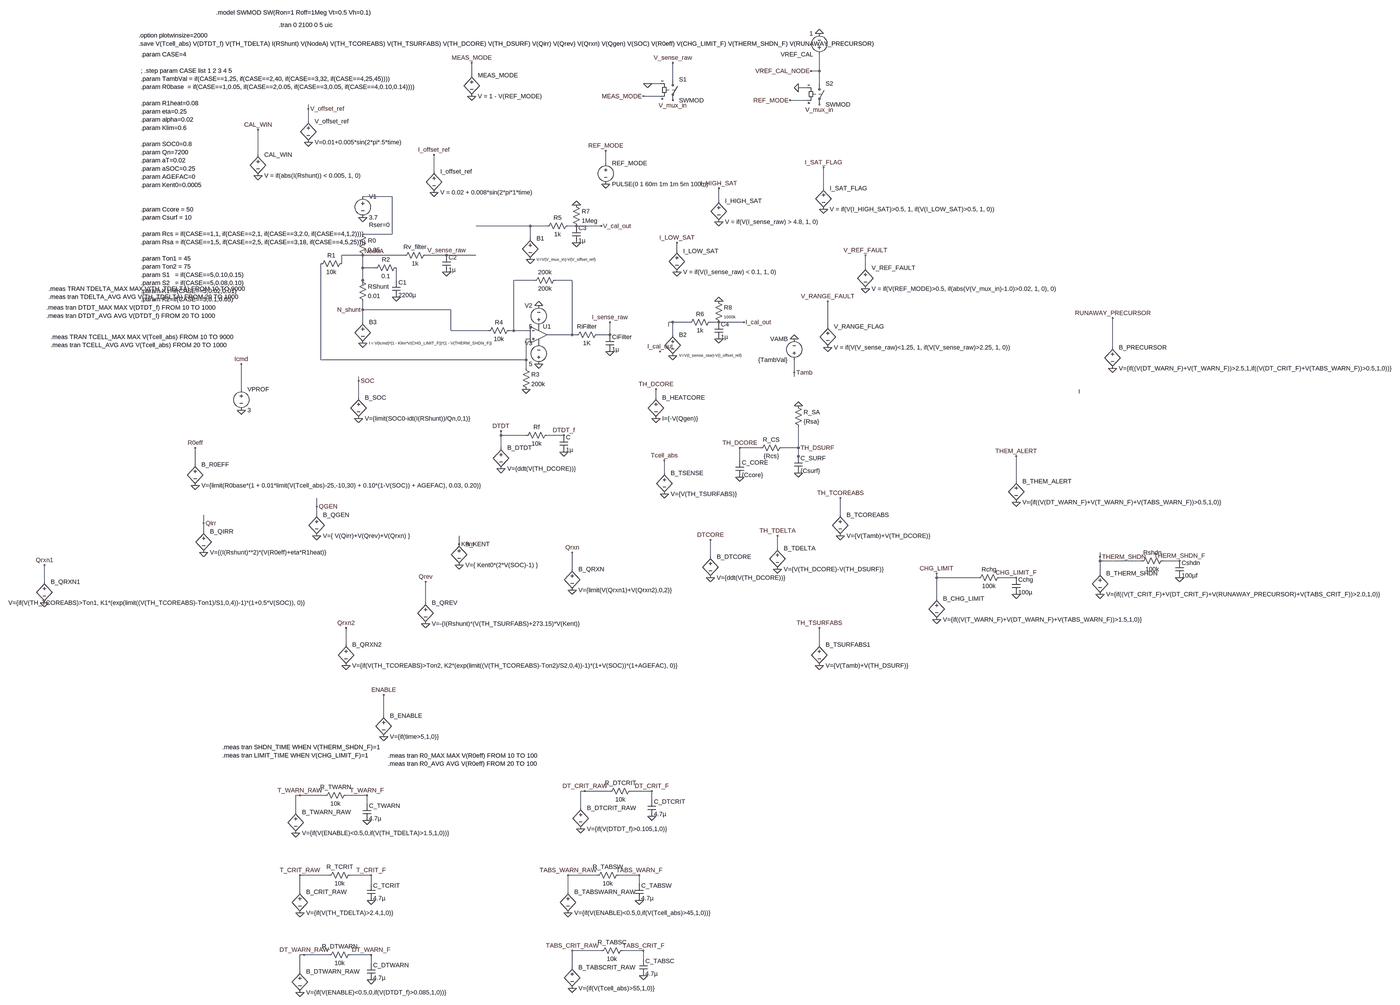
[diagram p0: schematic Thermalcase.asc, whole sheet]
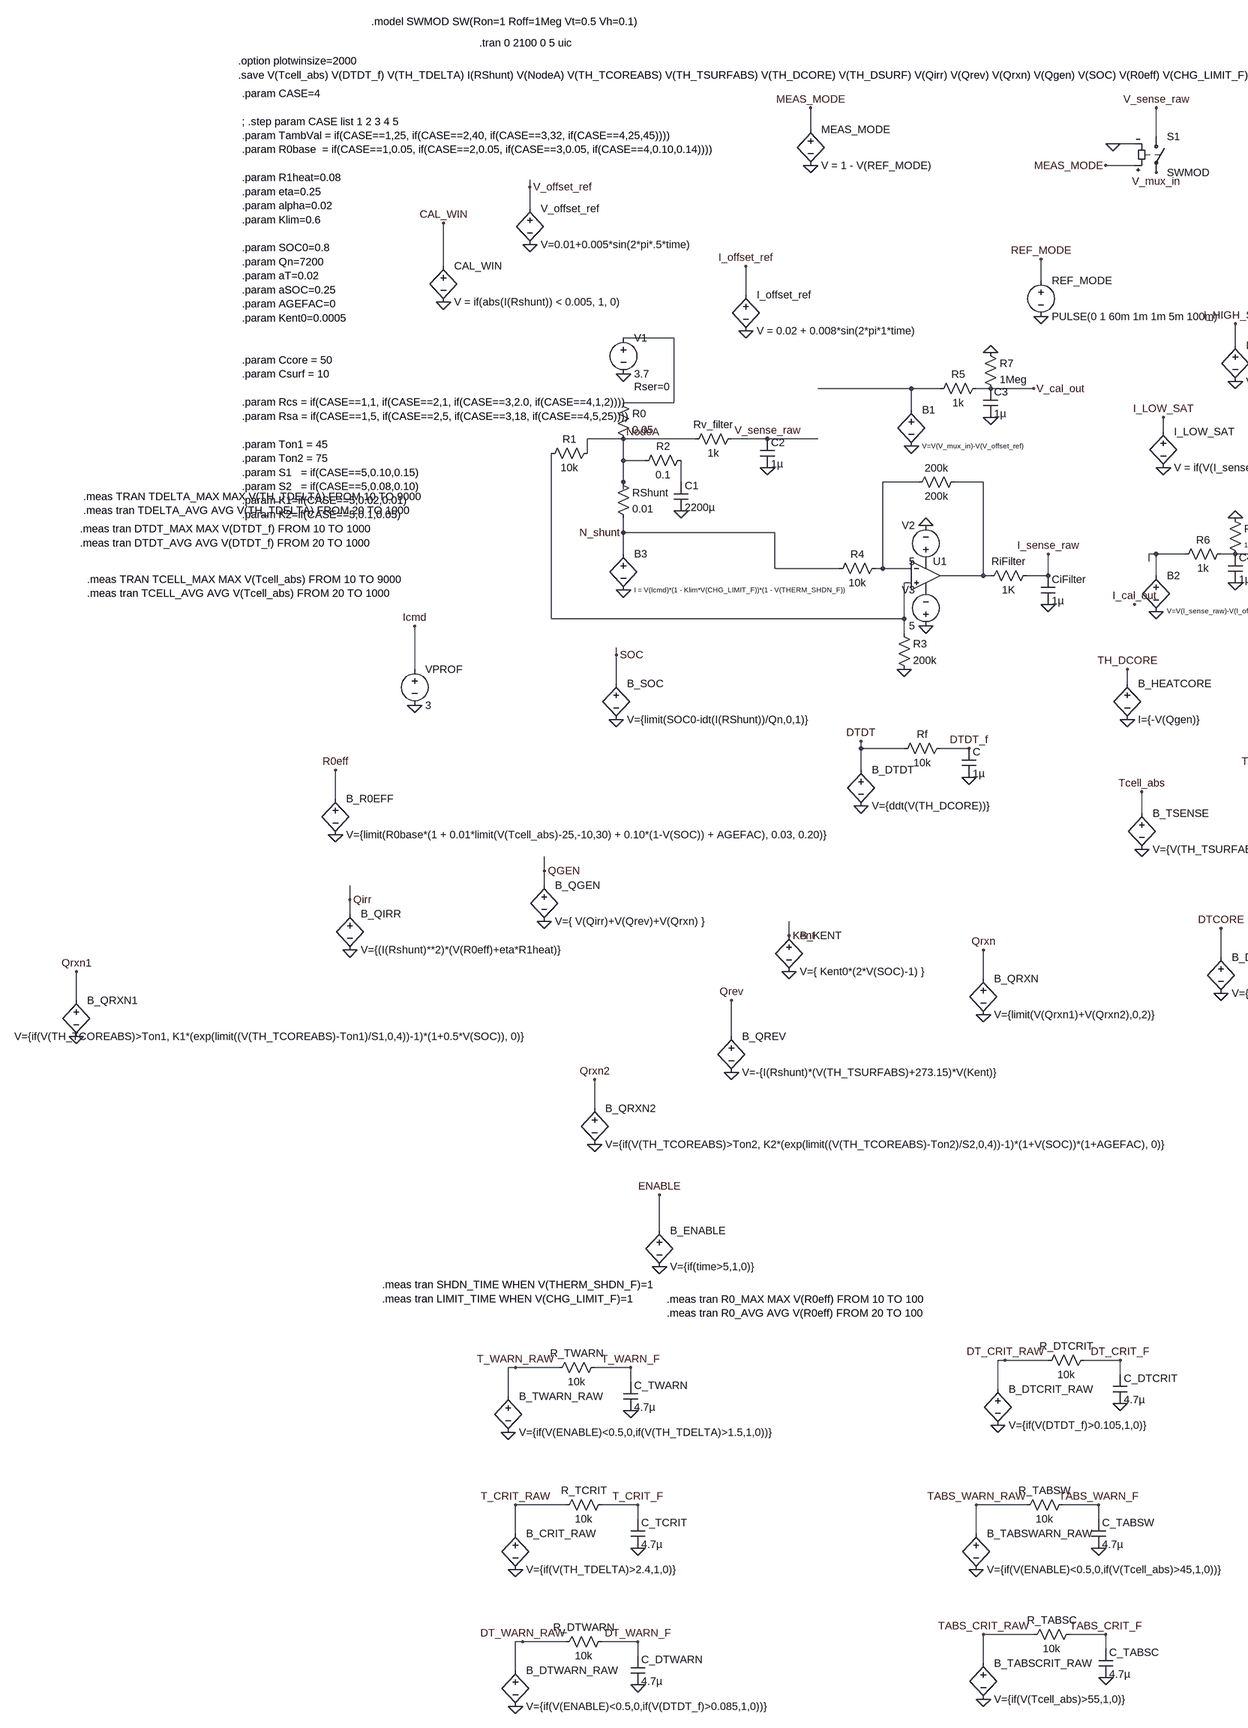
[diagram p1: schematic Thermalcase.asc, part, row 1 of 1, column 1 of 2]
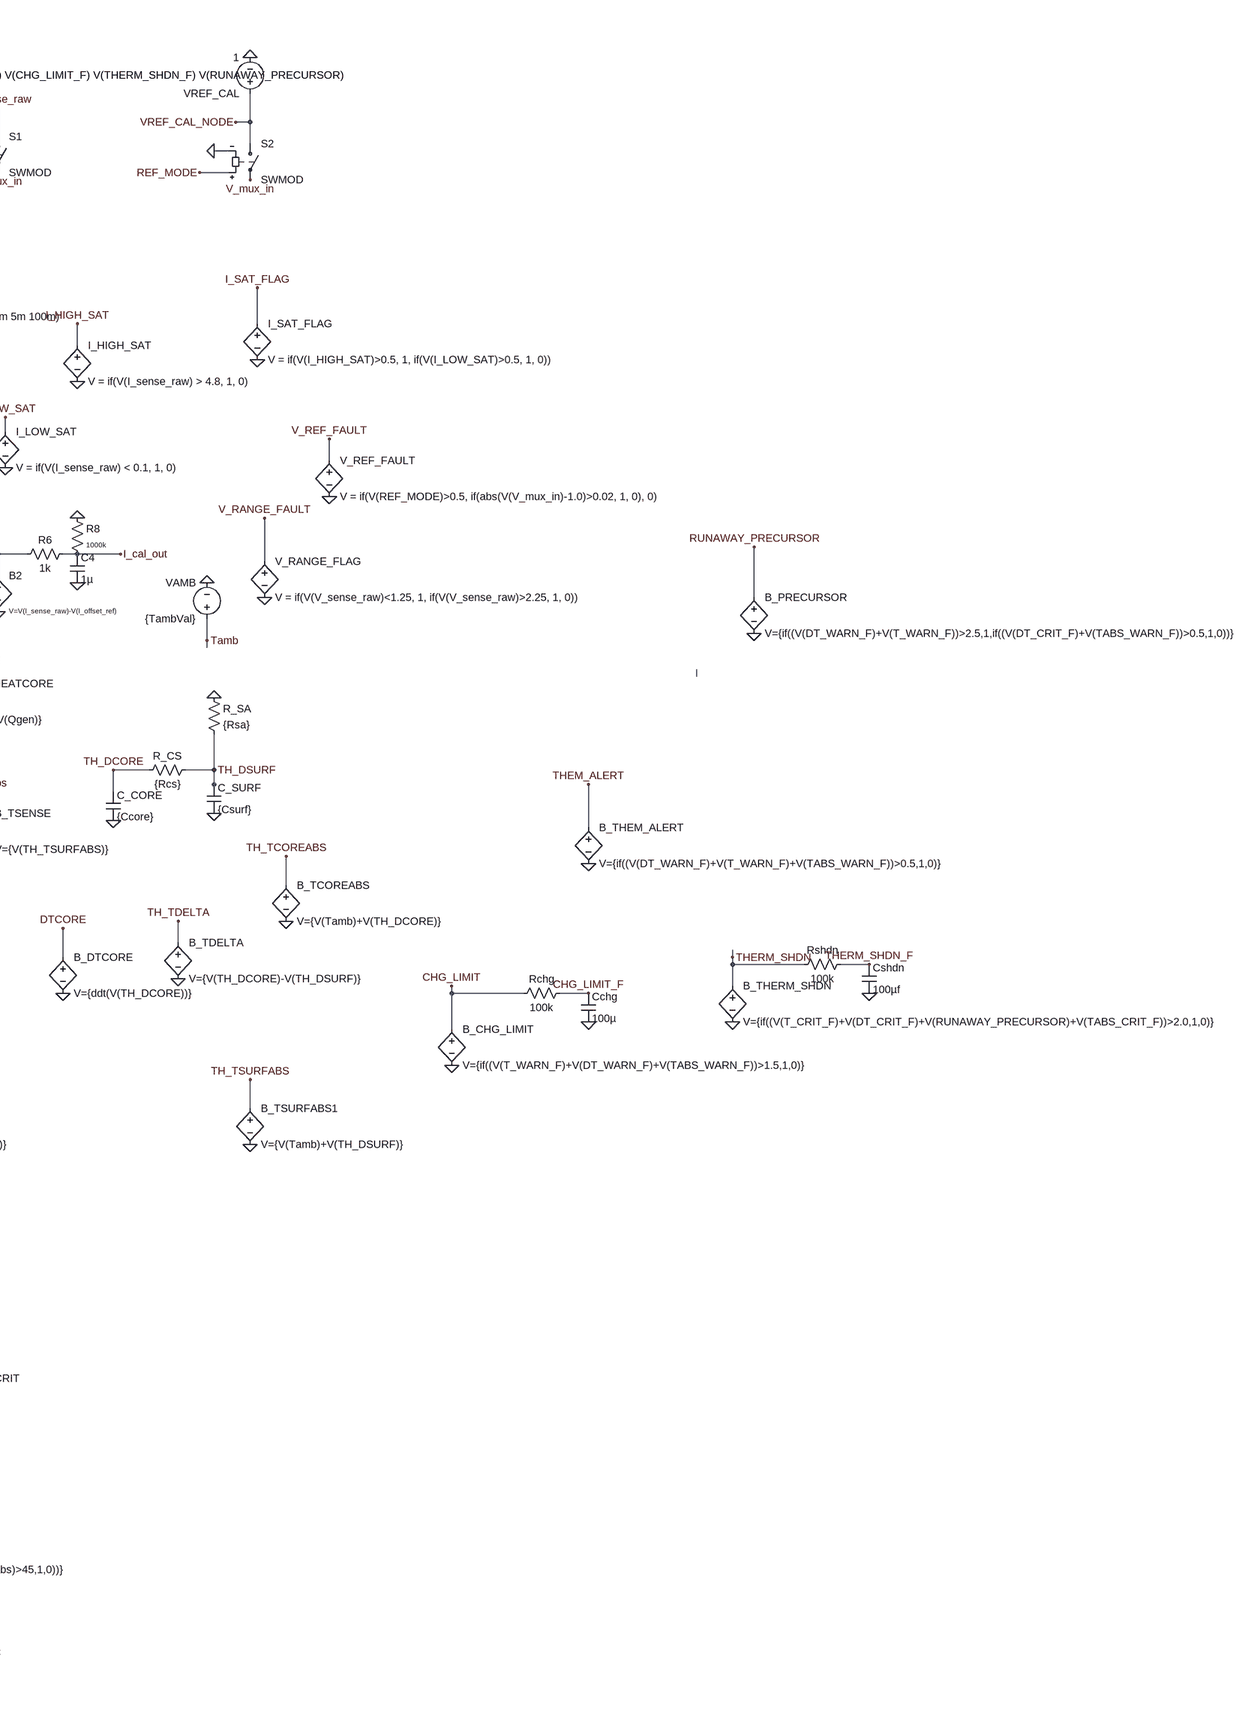
[diagram p2: schematic Thermalcase.asc, part, row 1 of 1, column 2 of 2]
Thermalcase.asc, the LTspice schematic file:
Version 4.1
SHEET 1 4508 3460
WIRE 1728 -464 1728 -528
WIRE 1728 -464 1696 -464
WIRE 400 -448 400 -496
WIRE 1168 -432 1168 -496
WIRE 1072 -416 1056 -416
WIRE 1120 -416 1072 -416
WIRE 1728 -416 1728 -464
WIRE 1680 -400 1648 -400
WIRE 1120 -368 1056 -368
WIRE 1680 -352 1616 -352
WIRE -224 -320 -224 -336
WIRE -224 -272 -224 -320
WIRE -416 -144 -416 -240
WIRE 912 -112 912 -160
WIRE 256 -80 256 -144
WIRE 1744 -16 1744 -96
WIRE 96 16 -16 16
WIRE 1344 32 1344 -16
WIRE 624 128 416 128
WIRE 688 128 624 128
WIRE 800 128 768 128
WIRE 896 128 800 128
WIRE 96 160 96 16
WIRE 96 160 -16 160
WIRE 624 176 624 128
WIRE 1184 224 1184 192
WIRE -16 240 -96 240
WIRE 144 240 -16 240
WIRE 304 240 224 240
WIRE 416 240 304 240
WIRE -96 272 -96 240
WIRE -16 288 -16 240
WIRE 32 288 -16 288
WIRE 1904 288 1904 240
WIRE -16 336 -16 288
WIRE 112 336 112 288
WIRE 640 336 560 336
WIRE 784 336 720 336
WIRE -16 352 -16 336
WIRE -16 448 -16 416
WIRE 320 448 -16 448
WIRE -16 496 -16 448
WIRE 1168 496 1152 496
WIRE 1232 496 1168 496
WIRE 1344 496 1312 496
WIRE 1440 496 1344 496
WIRE 1152 512 1152 496
WIRE 1760 512 1760 416
WIRE 320 528 320 448
WIRE 464 528 320 528
WIRE 560 528 560 336
WIRE 560 528 544 528
WIRE 624 528 560 528
WIRE 784 544 784 336
WIRE 784 544 688 544
WIRE 800 544 784 544
WIRE 928 544 928 496
WIRE 928 544 880 544
WIRE 1168 544 1168 496
WIRE 624 560 608 560
WIRE 2848 592 2848 480
WIRE -176 640 -176 272
WIRE 608 640 608 560
WIRE 608 640 -176 640
WIRE 608 672 608 640
WIRE 1632 688 1632 640
WIRE 1632 704 1632 688
WIRE -32 720 -32 704
WIRE -480 752 -480 656
WIRE 2720 768 2720 752
WIRE -32 784 -32 720
WIRE 1104 784 1104 752
WIRE 512 928 512 912
WIRE 608 928 512 928
WIRE 752 928 688 928
WIRE 512 976 512 928
WIRE 1504 976 1424 976
WIRE 1648 976 1648 896
WIRE 1648 976 1584 976
WIRE 1648 1008 1648 976
WIRE 1424 1024 1424 976
WIRE 1648 1024 1648 1008
WIRE -656 1040 -656 976
WIRE 1136 1072 1136 1024
WIRE 2480 1104 2480 1008
WIRE -192 1200 -192 1168
WIRE -192 1232 -192 1200
WIRE 1808 1232 1808 1168
WIRE -624 1264 -624 1232
WIRE -624 1296 -624 1264
WIRE 352 1344 352 1312
WIRE 1568 1360 1568 1312
WIRE 1312 1392 1312 1328
WIRE 2800 1392 2800 1376
WIRE 2800 1408 2800 1392
WIRE 2960 1408 2800 1408
WIRE 3104 1408 3040 1408
WIRE 784 1440 784 1376
WIRE 2800 1456 2800 1408
WIRE 2176 1472 2176 1456
WIRE 2336 1472 2176 1472
WIRE 2480 1472 2416 1472
WIRE -1232 1488 -1232 1424
WIRE 2176 1552 2176 1472
WIRE 224 1568 224 1488
WIRE -80 1728 -80 1664
WIRE 1728 1728 1728 1664
WIRE 64 2000 64 1920
WIRE 832 2288 816 2288
WIRE 928 2288 832 2288
WIRE 1088 2288 1008 2288
WIRE -256 2304 -272 2304
WIRE -160 2304 -256 2304
WIRE 0 2304 -80 2304
WIRE 1088 2320 1088 2288
WIRE 0 2336 0 2304
WIRE 816 2352 816 2288
WIRE -272 2368 -272 2304
WIRE -144 2656 -256 2656
WIRE 16 2656 -64 2656
WIRE 880 2656 768 2656
WIRE 1040 2656 960 2656
WIRE 16 2688 16 2656
WIRE 1040 2688 1040 2656
WIRE -256 2720 -256 2656
WIRE 768 2720 768 2656
WIRE 896 2944 784 2944
WIRE 1056 2944 976 2944
WIRE -240 2960 -256 2960
WIRE -144 2960 -240 2960
WIRE 16 2960 -64 2960
WIRE 1056 2976 1056 2944
WIRE 16 2992 16 2960
WIRE 784 3008 784 2944
WIRE -256 3024 -256 2960
FLAG -16 448 N_shunt
FLAG 304 240 V_sense_raw
FLAG -16 240 NodeA
FLAG 928 608 0
FLAG 928 496 I_sense_raw
FLAG -16 96 0
FLAG 608 752 0
FLAG 656 656 0
FLAG 656 432 0
FLAG 624 256 0
FLAG 800 192 0
FLAG 1344 560 0
FLAG 800 48 0
FLAG 1344 416 0
FLAG -224 -192 0
FLAG 256 0 0
FLAG 1728 -608 0
FLAG -416 -64 0
FLAG 1120 608 I_cal_out
FLAG 1440 496 I_cal_out
FLAG 896 128 V_cal_out
FLAG 912 -32 0
FLAG 1056 -368 MEAS_MODE
FLAG 1168 -496 V_sense_raw
FLAG 1168 -352 V_mux_in
FLAG 1696 -464 VREF_CAL_NODE
FLAG 1728 -336 V_mux_in
FLAG 1616 -352 REF_MODE
FLAG 1344 112 0
FLAG 1744 64 0
FLAG 1904 368 0
FLAG 1184 304 0
FLAG 1760 592 0
FLAG 400 -368 0
FLAG 1168 624 0
FLAG -416 -240 CAL_WIN
FLAG -224 -320 V_offset_ref
FLAG 400 -496 MEAS_MODE
FLAG 912 -160 REF_MODE
FLAG 1344 -16 I_HIGH_SAT
FLAG 1744 -96 I_SAT_FLAG
FLAG 1904 240 V_REF_FAULT
FLAG 1760 416 V_RANGE_FAULT
FLAG 1184 192 I_LOW_SAT
FLAG 256 -144 I_offset_ref
FLAG 1072 -416 0
FLAG 1648 -400 0
FLAG 1632 560 0
FLAG 512 912 DTDT
FLAG 512 1056 0
FLAG 752 992 0
FLAG 752 928 DTDT_f
FLAG 2480 1184 0
FLAG 2480 1008 THEM_ALERT
FLAG 2848 672 0
FLAG 2800 1536 0
FLAG 2848 480 RUNAWAY_PRECURSOR
FLAG 2800 1392 THERM_SHDN
FLAG 2176 1632 0
FLAG 2176 1456 CHG_LIMIT
FLAG 1632 688 Tamb
FLAG -480 832 0
FLAG -480 656 Icmd
FLAG -16 576 0
FLAG 2480 1536 0
FLAG 2480 1472 CHG_LIMIT_F
FLAG 3104 1472 0
FLAG 3104 1408 THERM_SHDN_F
FLAG -32 864 0
FLAG -656 1120 0
FLAG -624 1376 0
FLAG 352 1424 0
FLAG 224 1648 0
FLAG -32 720 SOC
FLAG -656 976 R0eff
FLAG 224 1488 Qrev
FLAG 784 1376 Qrxn
FLAG 352 1344 Kent
FLAG -192 1200 QGEN
FLAG -192 1312 0
FLAG 784 1520 0
FLAG 1648 1072 0
FLAG 1424 1088 0
FLAG 1648 976 TH_DSURF
FLAG 1424 976 TH_DCORE
FLAG 1104 752 TH_DCORE
FLAG 1104 864 0
FLAG 1136 1152 0
FLAG 1136 1024 Tcell_abs
FLAG 1568 1440 0
FLAG 1568 1312 TH_TDELTA
FLAG 1312 1472 0
FLAG 1312 1328 DTCORE
FLAG -1232 1424 Qrxn1
FLAG -1232 1568 0
FLAG -80 1664 Qrxn2
FLAG -80 1808 0
FLAG 1648 816 0
FLAG 1808 1312 0
FLAG 1808 1168 TH_TCOREABS
FLAG 1728 1808 0
FLAG 1728 1664 TH_TSURFABS
FLAG -624 1264 Qirr
FLAG 64 2080 0
FLAG 64 1920 ENABLE
FLAG -272 2448 0
FLAG 16 2752 0
FLAG -256 2800 0
FLAG -256 3104 0
FLAG 816 2432 0
FLAG 768 2800 0
FLAG 784 3088 0
FLAG 0 2400 0
FLAG 1088 2384 0
FLAG 1040 2752 0
FLAG 1056 3040 0
FLAG 16 3056 0
FLAG -256 2304 T_WARN_RAW
FLAG -256 2656 T_CRIT_RAW
FLAG -240 2960 DT_WARN_RAW
FLAG 832 2288 DT_CRIT_RAW
FLAG 768 2656 TABS_WARN_RAW
FLAG 784 2944 TABS_CRIT_RAW
FLAG 0 2304 T_WARN_F
FLAG 16 2656 T_CRIT_F
FLAG 16 2960 DT_WARN_F
FLAG 1088 2288 DT_CRIT_F
FLAG 1040 2656 TABS_WARN_F
FLAG 1056 2944 TABS_CRIT_F
FLAG 304 304 0
FLAG 112 400 0
SYMBOL voltage -16 0 R0
WINDOW 123 0 0 Left 0
WINDOW 39 24 124 Left 2
SYMATTR SpiceLine Rser=0
SYMATTR InstName V1
SYMATTR Value 3.7
SYMBOL res -32 144 R0
SYMATTR InstName R0
SYMATTR Value 0.05
SYMBOL res 128 272 R90
WINDOW 0 0 56 VBottom 2
WINDOW 3 32 56 VTop 2
SYMATTR InstName R2
SYMATTR Value 0.1
SYMBOL cap 96 336 R0
SYMATTR InstName C1
SYMATTR Value 2200µ
SYMBOL res 240 224 R90
WINDOW 0 0 56 VBottom 2
WINDOW 3 32 56 VTop 2
SYMATTR InstName Rv_filter
SYMATTR Value 1k
SYMBOL cap 288 240 R0
SYMATTR InstName C2
SYMATTR Value 1µ
SYMBOL res -32 320 R0
SYMATTR InstName RShunt
SYMATTR Value 0.01
SYMBOL res 896 528 R90
WINDOW 0 0 56 VBottom 2
WINDOW 3 32 56 VTop 2
SYMATTR InstName RiFilter
SYMATTR Value 1K
SYMBOL cap 912 544 R0
SYMATTR InstName CiFilter
SYMATTR Value 1µ
SYMBOL res -80 256 R90
WINDOW 0 0 56 VBottom 2
WINDOW 3 32 56 VTop 2
SYMATTR InstName R1
SYMATTR Value 10k
SYMBOL res 592 656 R0
SYMATTR InstName R3
SYMATTR Value 200k
SYMBOL res 560 512 R90
WINDOW 0 0 56 VBottom 2
WINDOW 3 32 56 VTop 2
SYMATTR InstName R4
SYMATTR Value 10k
SYMBOL res 736 320 R90
WINDOW 0 0 56 VBottom 2
WINDOW 3 32 56 VTop 2
SYMATTR InstName 200k
SYMATTR Value 200k
SYMBOL OpAmps\\UniversalOpAmp2 656 544 R0
SYMATTR InstName U1
SYMBOL voltage 656 528 R180
WINDOW 0 24 96 Left 2
WINDOW 3 24 16 Left 2
WINDOW 123 0 0 Left 0
WINDOW 39 0 0 Left 0
SYMATTR InstName V2
SYMATTR Value 5
SYMBOL voltage 656 672 R180
WINDOW 0 24 96 Left 2
WINDOW 3 24 16 Left 2
WINDOW 123 0 0 Left 0
WINDOW 39 0 0 Left 0
SYMATTR InstName V3
SYMATTR Value 5
SYMBOL bv 624 160 R0
WINDOW 3 24 96 Left 1
SYMATTR Value V=V(V_mux_in)-V(V_offset_ref)
SYMATTR InstName B1
SYMBOL bv 1168 528 R0
WINDOW 3 24 94 Left 1
SYMATTR Value V=V(I_sense_raw)-V(I_offset_ref)
SYMATTR InstName B2
SYMBOL res 784 112 R90
WINDOW 0 0 56 VBottom 2
WINDOW 3 32 56 VTop 2
SYMATTR InstName R5
SYMATTR Value 1k
SYMBOL cap 784 128 R0
SYMATTR InstName C3
SYMATTR Value 1µ
SYMBOL res 1328 480 R90
WINDOW 0 0 56 VBottom 2
WINDOW 3 32 56 VTop 2
SYMATTR InstName R6
SYMATTR Value 1k
SYMBOL cap 1328 496 R0
SYMATTR InstName C4
SYMATTR Value 1µ
SYMBOL res 784 32 R0
SYMATTR InstName R7
SYMATTR Value 1Meg
SYMBOL res 1328 400 R0
WINDOW 3 36 76 Left 1
SYMATTR Value 1000k
SYMATTR InstName R8
SYMBOL voltage 1728 -512 R180
WINDOW 123 0 0 Left 0
WINDOW 39 0 0 Left 0
SYMATTR InstName VREF_CAL
SYMATTR Value 1
SYMBOL bv -224 -288 R0
SYMATTR InstName V_offset_ref
SYMATTR Value V=0.01+0.005*sin(2*pi*.5*time)
SYMBOL bv 256 -96 R0
SYMATTR InstName I_offset_ref
SYMATTR Value V = 0.02 + 0.008*sin(2*pi*1*time)
SYMBOL bv -416 -160 R0
SYMATTR InstName CAL_WIN
SYMATTR Value V = if(abs(I(Rshunt)) < 0.005, 1, 0)
SYMBOL voltage 912 -128 R0
WINDOW 123 0 0 Left 0
WINDOW 39 0 0 Left 0
SYMATTR InstName REF_MODE
SYMATTR Value PULSE(0 1 60m 1m 1m 5m 100m)
SYMBOL sw 1168 -448 R0
SYMATTR InstName S1
SYMATTR Value SWMOD
SYMBOL sw 1728 -432 R0
SYMATTR InstName S2
SYMATTR Value SWMOD
SYMBOL bv 400 -464 R0
SYMATTR InstName MEAS_MODE
SYMATTR Value V = 1 - V(REF_MODE)
SYMBOL bv 1344 16 R0
SYMATTR InstName I_HIGH_SAT
SYMATTR Value V = if(V(I_sense_raw) > 4.8, 1, 0)
SYMBOL bv 1744 -32 R0
SYMATTR InstName I_SAT_FLAG
SYMATTR Value V = if(V(I_HIGH_SAT)>0.5, 1, if(V(I_LOW_SAT)>0.5, 1, 0))
SYMBOL bv 1184 208 R0
SYMATTR InstName I_LOW_SAT
SYMATTR Value V = if(V(I_sense_raw) < 0.1, 1, 0)
SYMBOL bv 1760 496 R0
SYMATTR InstName V_RANGE_FLAG
SYMATTR Value V = if(V(V_sense_raw)<1.25, 1, if(V(V_sense_raw)>2.25, 1, 0))
SYMBOL bv 1904 272 R0
SYMATTR InstName V_REF_FAULT
SYMATTR Value V = if(V(REF_MODE)>0.5, if(abs(V(V_mux_in)-1.0)>0.02, 1, 0), 0)
SYMBOL voltage 1632 656 R180
WINDOW 0 24 96 Left 2
WINDOW 3 24 16 Left 2
WINDOW 123 0 0 Left 0
WINDOW 39 0 0 Left 0
SYMATTR InstName VAMB
SYMATTR Value {TambVal}
SYMBOL bv 512 960 R0
SYMATTR InstName B_DTDT
SYMATTR Value V={ddt(V(TH_DCORE))}
SYMBOL res 704 912 R90
WINDOW 0 0 56 VBottom 2
WINDOW 3 32 56 VTop 2
SYMATTR InstName Rf
SYMATTR Value 10k
SYMBOL cap 736 928 R0
SYMATTR InstName C
SYMATTR Value 1µ
SYMBOL bv 2480 1088 R0
SYMATTR InstName B_THEM_ALERT
SYMATTR Value V={if((V(DT_WARN_F)+V(T_WARN_F)+V(TABS_WARN_F))>0.5,1,0)}
SYMBOL bv 2848 576 R0
SYMATTR InstName B_PRECURSOR
SYMATTR Value V={if((V(DT_WARN_F)+V(T_WARN_F))>2.5,1,if((V(DT_CRIT_F)+V(TABS_WARN_F))>0.5,1,0))}
SYMBOL bv 2800 1440 R0
SYMATTR InstName B_THERM_SHDN
SYMATTR Value V={if((V(T_CRIT_F)+V(DT_CRIT_F)+V(RUNAWAY_PRECURSOR)+V(TABS_CRIT_F))>2.0,1,0)}
SYMBOL bv 2176 1536 R0
SYMATTR InstName B_CHG_LIMIT
SYMATTR Value V={if((V(T_WARN_F)+V(DT_WARN_F)+V(TABS_WARN_F))>1.5,1,0)}
SYMBOL voltage -480 736 R0
WINDOW 123 0 0 Left 0
WINDOW 39 0 0 Left 0
SYMATTR InstName VPROF
SYMATTR Value 3
SYMBOL bv -16 480 R0
WINDOW 3 24 96 Left 1
SYMATTR Value I = V(Icmd)*(1 - Klim*V(CHG_LIMIT_F))*(1 - V(THERM_SHDN_F))
SYMATTR InstName B3
SYMBOL res 2432 1456 R90
WINDOW 0 0 56 VBottom 2
WINDOW 3 32 56 VTop 2
SYMATTR InstName Rchg
SYMATTR Value 100k
SYMBOL cap 2464 1472 R0
SYMATTR InstName Cchg
SYMATTR Value 100µ
SYMBOL res 3056 1392 R90
WINDOW 0 0 56 VBottom 2
WINDOW 3 32 56 VTop 2
SYMATTR InstName Rshdn
SYMATTR Value 100k
SYMBOL cap 3088 1408 R0
SYMATTR InstName Cshdn
SYMATTR Value 100µf
SYMBOL bv -32 768 R0
SYMATTR InstName B_SOC
SYMATTR Value V={limit(SOC0-idt(I(RShunt))/Qn,0,1)}
SYMBOL bv -656 1024 R0
SYMATTR Value V={limit(R0base*(1 + 0.01*limit(V(Tcell_abs)-25,-10,30) + 0.10*(1-V(SOC)) + AGEFAC), 0.03, 0.20)}
SYMATTR InstName B_R0EFF
SYMBOL bv -624 1280 R0
SYMATTR InstName B_QIRR
SYMATTR Value V={(I(Rshunt)**2)*(V(R0eff)+eta*R1heat)}
SYMBOL bv 352 1328 R0
SYMATTR InstName B_KENT
SYMATTR Value V={ Kent0*(2*V(SOC)-1) }
SYMBOL bv 224 1552 R0
SYMATTR InstName B_QREV
SYMATTR Value V=-{I(Rshunt)*(V(TH_TSURFABS)+273.15)*V(Kent)}
SYMBOL bv 784 1424 R0
SYMATTR InstName B_QRXN
SYMATTR Value V={limit(V(Qrxn1)+V(Qrxn2),0,2)}
SYMBOL bv -192 1216 R0
SYMATTR InstName B_QGEN
SYMATTR Value V={ V(Qirr)+V(Qrev)+V(Qrxn) }
SYMBOL res 1600 960 R90
WINDOW 0 0 56 VBottom 2
WINDOW 3 32 56 VTop 2
SYMATTR InstName R_CS
SYMATTR Value {Rcs}
SYMBOL cap 1632 1008 R0
SYMATTR InstName C_SURF
SYMATTR Value {Csurf}
SYMBOL cap 1408 1024 R0
SYMATTR InstName C_CORE
SYMATTR Value {Ccore}
SYMBOL res 1632 800 R0
SYMATTR InstName R_SA
SYMATTR Value {Rsa}
SYMBOL bv 1104 768 R0
SYMATTR InstName B_HEATCORE
SYMATTR Value I={-V(Qgen)}
SYMBOL bv 1136 1056 R0
SYMATTR InstName B_TSENSE
SYMATTR Value V={V(TH_TSURFABS)}
SYMBOL bv 1568 1344 R0
SYMATTR InstName B_TDELTA
SYMATTR Value V={V(TH_DCORE)-V(TH_DSURF)}
SYMBOL bv 1312 1376 R0
SYMATTR InstName B_DTCORE
SYMATTR Value V={ddt(V(TH_DCORE))}
SYMBOL bv -1232 1472 R0
WINDOW 3 428 96 Center 2
SYMATTR Value V={if(V(TH_TCOREABS)>Ton1, K1*(exp(limit((V(TH_TCOREABS)-Ton1)/S1,0,4))-1)*(1+0.5*V(SOC)), 0)}
SYMATTR InstName B_QRXN1
SYMBOL bv -80 1712 R0
SYMATTR Value V={if(V(TH_TCOREABS)>Ton2, K2*(exp(limit((V(TH_TCOREABS)-Ton2)/S2,0,4))-1)*(1+V(SOC))*(1+AGEFAC), 0)}
SYMATTR InstName B_QRXN2
SYMBOL bv 1808 1216 R0
SYMATTR InstName B_TCOREABS
SYMATTR Value V={V(Tamb)+V(TH_DCORE)}
SYMBOL bv 1728 1712 R0
SYMATTR InstName B_TSURFABS1
SYMATTR Value V={V(Tamb)+V(TH_DSURF)}
SYMBOL bv 64 1984 R0
SYMATTR InstName B_ENABLE
SYMATTR Value V={if(time>5,1,0)}
SYMBOL bv -272 2352 R0
SYMATTR InstName B_TWARN_RAW
SYMATTR Value V={if(V(ENABLE)<0.5,0,if(V(TH_TDELTA)>1.5,1,0))}
SYMBOL res -64 2288 R90
WINDOW 0 0 56 VBottom 2
WINDOW 3 32 56 VTop 2
SYMATTR InstName R_TWARN
SYMATTR Value 10k
SYMBOL bv -256 2704 R0
SYMATTR InstName B_CRIT_RAW
SYMATTR Value V={if(V(TH_TDELTA)>2.4,1,0)}
SYMBOL res -48 2640 R90
WINDOW 0 0 56 VBottom 2
WINDOW 3 32 56 VTop 2
SYMATTR InstName R_TCRIT
SYMATTR Value 10k
SYMBOL cap 0 2688 R0
SYMATTR InstName C_TCRIT
SYMATTR Value 4.7µ
SYMBOL bv -256 3008 R0
SYMATTR InstName B_DTWARN_RAW
SYMATTR Value V={if(V(ENABLE)<0.5,0,if(V(DTDT_f)>0.085,1,0))}
SYMBOL res -48 2944 R90
WINDOW 0 0 56 VBottom 2
WINDOW 3 32 56 VTop 2
SYMATTR InstName R_DTWARN
SYMATTR Value 10k
SYMBOL bv 816 2336 R0
SYMATTR InstName B_DTCRIT_RAW
SYMATTR Value V={if(V(DTDT_f)>0.105,1,0)}
SYMBOL res 1024 2272 R90
WINDOW 0 0 56 VBottom 2
WINDOW 3 32 56 VTop 2
SYMATTR InstName R_DTCRIT
SYMATTR Value 10k
SYMBOL bv 768 2704 R0
SYMATTR InstName B_TABSWARN_RAW
SYMATTR Value V={if(V(ENABLE)<0.5,0,if(V(Tcell_abs)>45,1,0))}
SYMBOL res 976 2640 R90
WINDOW 0 0 56 VBottom 2
WINDOW 3 32 56 VTop 2
SYMATTR InstName R_TABSW
SYMATTR Value 10k
SYMBOL bv 784 2992 R0
SYMATTR InstName B_TABSCRIT_RAW
SYMATTR Value V={if(V(Tcell_abs)>55,1,0)}
SYMBOL res 992 2928 R90
WINDOW 0 0 56 VBottom 2
WINDOW 3 32 56 VTop 2
SYMATTR InstName R_TABSC
SYMATTR Value 10k
SYMBOL cap -16 2336 R0
SYMATTR InstName C_TWARN
SYMATTR Value 4.7µ
SYMBOL cap 1072 2320 R0
SYMATTR InstName C_DTCRIT
SYMATTR Value 4.7µ
SYMBOL cap 1024 2688 R0
SYMATTR InstName C_TABSW
SYMATTR Value 4.7µ
SYMBOL cap 1040 2976 R0
SYMATTR InstName C_TABSC
SYMATTR Value 4.7µ
SYMBOL cap 0 2992 R0
SYMATTR InstName C_DTWARN
SYMATTR Value 4.7µ
TEXT -336 -640 Left 2 !.tran 0 2100 0 5 uic
TEXT -576 -688 Left 2 !.model SWMOD SW(Ron=1 Roff=1Meg Vt=0.5 Vh=0.1)
TEXT -864 -528 Left 2 !.param CASE=4\n \n; .step param CASE list 1 2 3 4 5\n.param TambVal = if(CASE==1,25, if(CASE==2,40, if(CASE==3,32, if(CASE==4,25,45))))\n.param R0base  = if(CASE==1,0.05, if(CASE==2,0.05, if(CASE==3,0.05, if(CASE==4,0.10,0.14))))\n \n.param R1heat=0.08\n.param eta=0.25\n.param alpha=0.02\n.param Klim=0.6\n \n.param SOC0=0.8\n.param Qn=7200\n.param aT=0.02\n.param aSOC=0.25\n.param AGEFAC=0\n.param Kent0=0.0005\n \n \n.param Ccore = 50\n.param Csurf = 10\n \n.param Rcs = if(CASE==1,1, if(CASE==2,1, if(CASE==3,2.0, if(CASE==4,1,2))))\n.param Rsa = if(CASE==1,5, if(CASE==2,5, if(CASE==3,18, if(CASE==4,5,25))))\n \n.param Ton1 = 45     \n.param Ton2 = 75    \n.param S1   = if(CASE==5,0.10,0.15)\n.param S2   = if(CASE==5,0.08,0.10)\n.param K1=if(CASE==5,0.02,0.01)\n.param K2=if(CASE==5,0.1,0.05)
TEXT -1216 368 Left 2 !.meas TRAN TDELTA_MAX MAX V(TH_TDELTA) FROM 10 TO 9000\n.meas tran TDELTA_AVG AVG V(TH_TDELTA) FROM 20 TO 1000
TEXT -1224 440 Left 2 !.meas tran DTDT_MAX MAX V(DTDT_f) FROM 10 TO 1000\n.meas tran DTDT_AVG AVG V(DTDT_f) FROM 20 TO 1000
TEXT -1208 552 Left 2 !.meas TRAN TCELL_MAX MAX V(Tcell_abs) FROM 10 TO 9000\n.meas tran TCELL_AVG AVG V(Tcell_abs) FROM 20 TO 1000
TEXT -552 2120 Left 2 !.meas tran SHDN_TIME WHEN V(THERM_SHDN_F)=1\n.meas tran LIMIT_TIME WHEN V(CHG_LIMIT_F)=1
TEXT 80 2152 Left 2 !.meas tran R0_MAX MAX V(R0eff) FROM 10 TO 100\n.meas tran R0_AVG AVG V(R0eff) FROM 20 TO 100
TEXT -872 -600 Left 2 !.option plotwinsize=2000\n.save V(Tcell_abs) V(DTDT_f) V(TH_TDELTA) I(RShunt) V(NodeA) V(TH_TCOREABS) V(TH_TSURFABS) V(TH_DCORE) V(TH_DSURF) V(Qirr) V(Qrev) V(Qrxn) V(Qgen) V(SOC) V(R0eff) V(CHG_LIMIT_F) V(THERM_SHDN_F) V(RUNAWAY_PRECURSOR)

The netlist it stands for:
* Thermalcase.asc
V1 N001 0 3.7 Rser=0
R0 N001 NodeA 0.05
R2 N003 NodeA 0.1
C1 N003 0 2200µ
Rv_filter V_sense_raw NodeA 1k
C2 V_sense_raw 0 1µ
RShunt NodeA N_shunt 0.01
RiFilter I_sense_raw N005 1K
CiFilter I_sense_raw 0 1µ
R1 NodeA N007 10k
R3 N007 0 200k
R4 N004 N_shunt 10k
R§200k N005 N004 200k
X§U1 N007 N004 P001 P002 N005 level2 Avol=1Meg GBW=10Meg Slew=10Meg Ilimit=25m Rail=0 Vos=0 En=0 Enk=0 In=0 Ink=0 Rin=500Meg  ; pins In+ In- V+ V- OUT
V2 P001 0 5
V3 0 P002 5
B1 N002 0 V=V(V_mux_in)-V(V_offset_ref)
B2 N006 0 V=V(I_sense_raw)-V(I_offset_ref)
R5 V_cal_out N002 1k
C3 V_cal_out 0 1µ
R6 I_cal_out N006 1k
C4 I_cal_out 0 1µ
R7 0 V_cal_out 1Meg
R8 0 I_cal_out 1000k
VREF_CAL VREF_CAL_NODE 0 1
B§V_offset_ref V_offset_ref 0 V=0.01+0.005*sin(2*pi*.5*time)
B§I_offset_ref I_offset_ref 0 V = 0.02 + 0.008*sin(2*pi*1*time)
B§CAL_WIN CAL_WIN 0 V = if(abs(I(Rshunt)) < 0.005, 1, 0)
V§REF_MODE REF_MODE 0 PULSE(0 1 60m 1m 1m 5m 100m)
S1 V_sense_raw V_mux_in MEAS_MODE 0 SWMOD
S2 VREF_CAL_NODE V_mux_in REF_MODE 0 SWMOD
B§MEAS_MODE MEAS_MODE 0 V = 1 - V(REF_MODE)
B§I_HIGH_SAT I_HIGH_SAT 0 V = if(V(I_sense_raw) > 4.8, 1, 0)
B§I_SAT_FLAG I_SAT_FLAG 0 V = if(V(I_HIGH_SAT)>0.5, 1, if(V(I_LOW_SAT)>0.5, 1, 0))
B§I_LOW_SAT I_LOW_SAT 0 V = if(V(I_sense_raw) < 0.1, 1, 0)
B§V_RANGE_FLAG V_RANGE_FAULT 0 V = if(V(V_sense_raw)<1.25, 1, if(V(V_sense_raw)>2.25, 1, 0))
B§V_REF_FAULT V_REF_FAULT 0 V = if(V(REF_MODE)>0.5, if(abs(V(V_mux_in)-1.0)>0.02, 1, 0), 0)
VAMB Tamb 0 {TambVal}
B_DTDT DTDT 0 V={ddt(V(TH_DCORE))}
Rf DTDT_f DTDT 10k
C DTDT_f 0 1µ
B_THEM_ALERT THEM_ALERT 0 V={if((V(DT_WARN_F)+V(T_WARN_F)+V(TABS_WARN_F))>0.5,1,0)}
B_PRECURSOR RUNAWAY_PRECURSOR 0 V={if((V(DT_WARN_F)+V(T_WARN_F))>2.5,1,if((V(DT_CRIT_F)+V(TABS_WARN_F))>0.5,1,0))}
B_THERM_SHDN THERM_SHDN 0 V={if((V(T_CRIT_F)+V(DT_CRIT_F)+V(RUNAWAY_PRECURSOR)+V(TABS_CRIT_F))>2.0,1,0)}
B_CHG_LIMIT CHG_LIMIT 0 V={if((V(T_WARN_F)+V(DT_WARN_F)+V(TABS_WARN_F))>1.5,1,0)}
VPROF Icmd 0 3
B3 N_shunt 0 I = V(Icmd)*(1 - Klim*V(CHG_LIMIT_F))*(1 - V(THERM_SHDN_F))
Rchg CHG_LIMIT_F CHG_LIMIT 100k
Cchg CHG_LIMIT_F 0 100µ
Rshdn THERM_SHDN_F THERM_SHDN 100k
Cshdn THERM_SHDN_F 0 100µf
B_SOC SOC 0 V={limit(SOC0-idt(I(RShunt))/Qn,0,1)}
B_R0EFF R0eff 0 V={limit(R0base*(1 + 0.01*limit(V(Tcell_abs)-25,-10,30) + 0.10*(1-V(SOC)) + AGEFAC), 0.03, 0.20)}
B_QIRR Qirr 0 V={(I(Rshunt)**2)*(V(R0eff)+eta*R1heat)}
B_KENT Kent 0 V={ Kent0*(2*V(SOC)-1) }
B_QREV Qrev 0 V=-{I(Rshunt)*(V(TH_TSURFABS)+273.15)*V(Kent)}
B_QRXN Qrxn 0 V={limit(V(Qrxn1)+V(Qrxn2),0,2)}
B_QGEN QGEN 0 V={ V(Qirr)+V(Qrev)+V(Qrxn) }
R_CS TH_DSURF TH_DCORE {Rcs}
C_SURF TH_DSURF 0 {Csurf}
C_CORE TH_DCORE 0 {Ccore}
R_SA 0 TH_DSURF {Rsa}
B_HEATCORE TH_DCORE 0 I={-V(Qgen)}
B_TSENSE Tcell_abs 0 V={V(TH_TSURFABS)}
B_TDELTA TH_TDELTA 0 V={V(TH_DCORE)-V(TH_DSURF)}
B_DTCORE DTCORE 0 V={ddt(V(TH_DCORE))}
B_QRXN1 Qrxn1 0 V={if(V(TH_TCOREABS)>Ton1, K1*(exp(limit((V(TH_TCOREABS)-Ton1)/S1,0,4))-1)*(1+0.5*V(SOC)), 0)}
B_QRXN2 Qrxn2 0 V={if(V(TH_TCOREABS)>Ton2, K2*(exp(limit((V(TH_TCOREABS)-Ton2)/S2,0,4))-1)*(1+V(SOC))*(1+AGEFAC), 0)}
B_TCOREABS TH_TCOREABS 0 V={V(Tamb)+V(TH_DCORE)}
B_TSURFABS1 TH_TSURFABS 0 V={V(Tamb)+V(TH_DSURF)}
B_ENABLE ENABLE 0 V={if(time>5,1,0)}
B_TWARN_RAW T_WARN_RAW 0 V={if(V(ENABLE)<0.5,0,if(V(TH_TDELTA)>1.5,1,0))}
R_TWARN T_WARN_F T_WARN_RAW 10k
B_CRIT_RAW T_CRIT_RAW 0 V={if(V(TH_TDELTA)>2.4,1,0)}
R_TCRIT T_CRIT_F T_CRIT_RAW 10k
C_TCRIT T_CRIT_F 0 4.7µ
B_DTWARN_RAW DT_WARN_RAW 0 V={if(V(ENABLE)<0.5,0,if(V(DTDT_f)>0.085,1,0))}
R_DTWARN DT_WARN_F DT_WARN_RAW 10k
B_DTCRIT_RAW DT_CRIT_RAW 0 V={if(V(DTDT_f)>0.105,1,0)}
R_DTCRIT DT_CRIT_F DT_CRIT_RAW 10k
B_TABSWARN_RAW TABS_WARN_RAW 0 V={if(V(ENABLE)<0.5,0,if(V(Tcell_abs)>45,1,0))}
R_TABSW TABS_WARN_F TABS_WARN_RAW 10k
B_TABSCRIT_RAW TABS_CRIT_RAW 0 V={if(V(Tcell_abs)>55,1,0)}
R_TABSC TABS_CRIT_F TABS_CRIT_RAW 10k
C_TWARN T_WARN_F 0 4.7µ
C_DTCRIT DT_CRIT_F 0 4.7µ
C_TABSW TABS_WARN_F 0 4.7µ
C_TABSC TABS_CRIT_F 0 4.7µ
C_DTWARN DT_WARN_F 0 4.7µ
.tran 0 2100 0 5 uic
.model SWMOD SW(Ron=1 Roff=1Meg Vt=0.5 Vh=0.1)
.param CASE=4
; .step param CASE list 1 2 3 4 5
.param TambVal = if(CASE==1,25, if(CASE==2,40, if(CASE==3,32, if(CASE==4,25,45))))
.param R0base  = if(CASE==1,0.05, if(CASE==2,0.05, if(CASE==3,0.05, if(CASE==4,0.10,0.14))))
.param R1heat=0.08
.param eta=0.25
.param alpha=0.02
.param Klim=0.6
.param SOC0=0.8
.param Qn=7200
.param aT=0.02
.param aSOC=0.25
.param AGEFAC=0
.param Kent0=0.0005
.param Ccore = 50
.param Csurf = 10
.param Rcs = if(CASE==1,1, if(CASE==2,1, if(CASE==3,2.0, if(CASE==4,1,2))))
.param Rsa = if(CASE==1,5, if(CASE==2,5, if(CASE==3,18, if(CASE==4,5,25))))
.param Ton1 = 45
.param Ton2 = 75
.param S1   = if(CASE==5,0.10,0.15)
.param S2   = if(CASE==5,0.08,0.10)
.param K1=if(CASE==5,0.02,0.01)
.param K2=if(CASE==5,0.1,0.05)
.meas TRAN TDELTA_MAX MAX V(TH_TDELTA) FROM 10 TO 9000
.meas tran TDELTA_AVG AVG V(TH_TDELTA) FROM 20 TO 1000
.meas tran DTDT_MAX MAX V(DTDT_f) FROM 10 TO 1000
.meas tran DTDT_AVG AVG V(DTDT_f) FROM 20 TO 1000
.meas TRAN TCELL_MAX MAX V(Tcell_abs) FROM 10 TO 9000
.meas tran TCELL_AVG AVG V(Tcell_abs) FROM 20 TO 1000
.meas tran SHDN_TIME WHEN V(THERM_SHDN_F)=1
.meas tran LIMIT_TIME WHEN V(CHG_LIMIT_F)=1
.meas tran R0_MAX MAX V(R0eff) FROM 10 TO 100
.meas tran R0_AVG AVG V(R0eff) FROM 20 TO 100
.option plotwinsize=2000
.save V(Tcell_abs) V(DTDT_f) V(TH_TDELTA) I(RShunt) V(NodeA) V(TH_TCOREABS) V(TH_TSURFABS) V(TH_DCORE) V(TH_DSURF) V(Qirr) V(Qrev) V(Qrxn) V(Qgen) V(SOC) V(R0eff) V(CHG_LIMIT_F) V(THERM_SHDN_F) V(RUNAWAY_PRECURSOR)
.lib UniversalOpAmp2.lib
.backanno
.end